# EAGLE design nr1 (EAGLE 6.6.0)
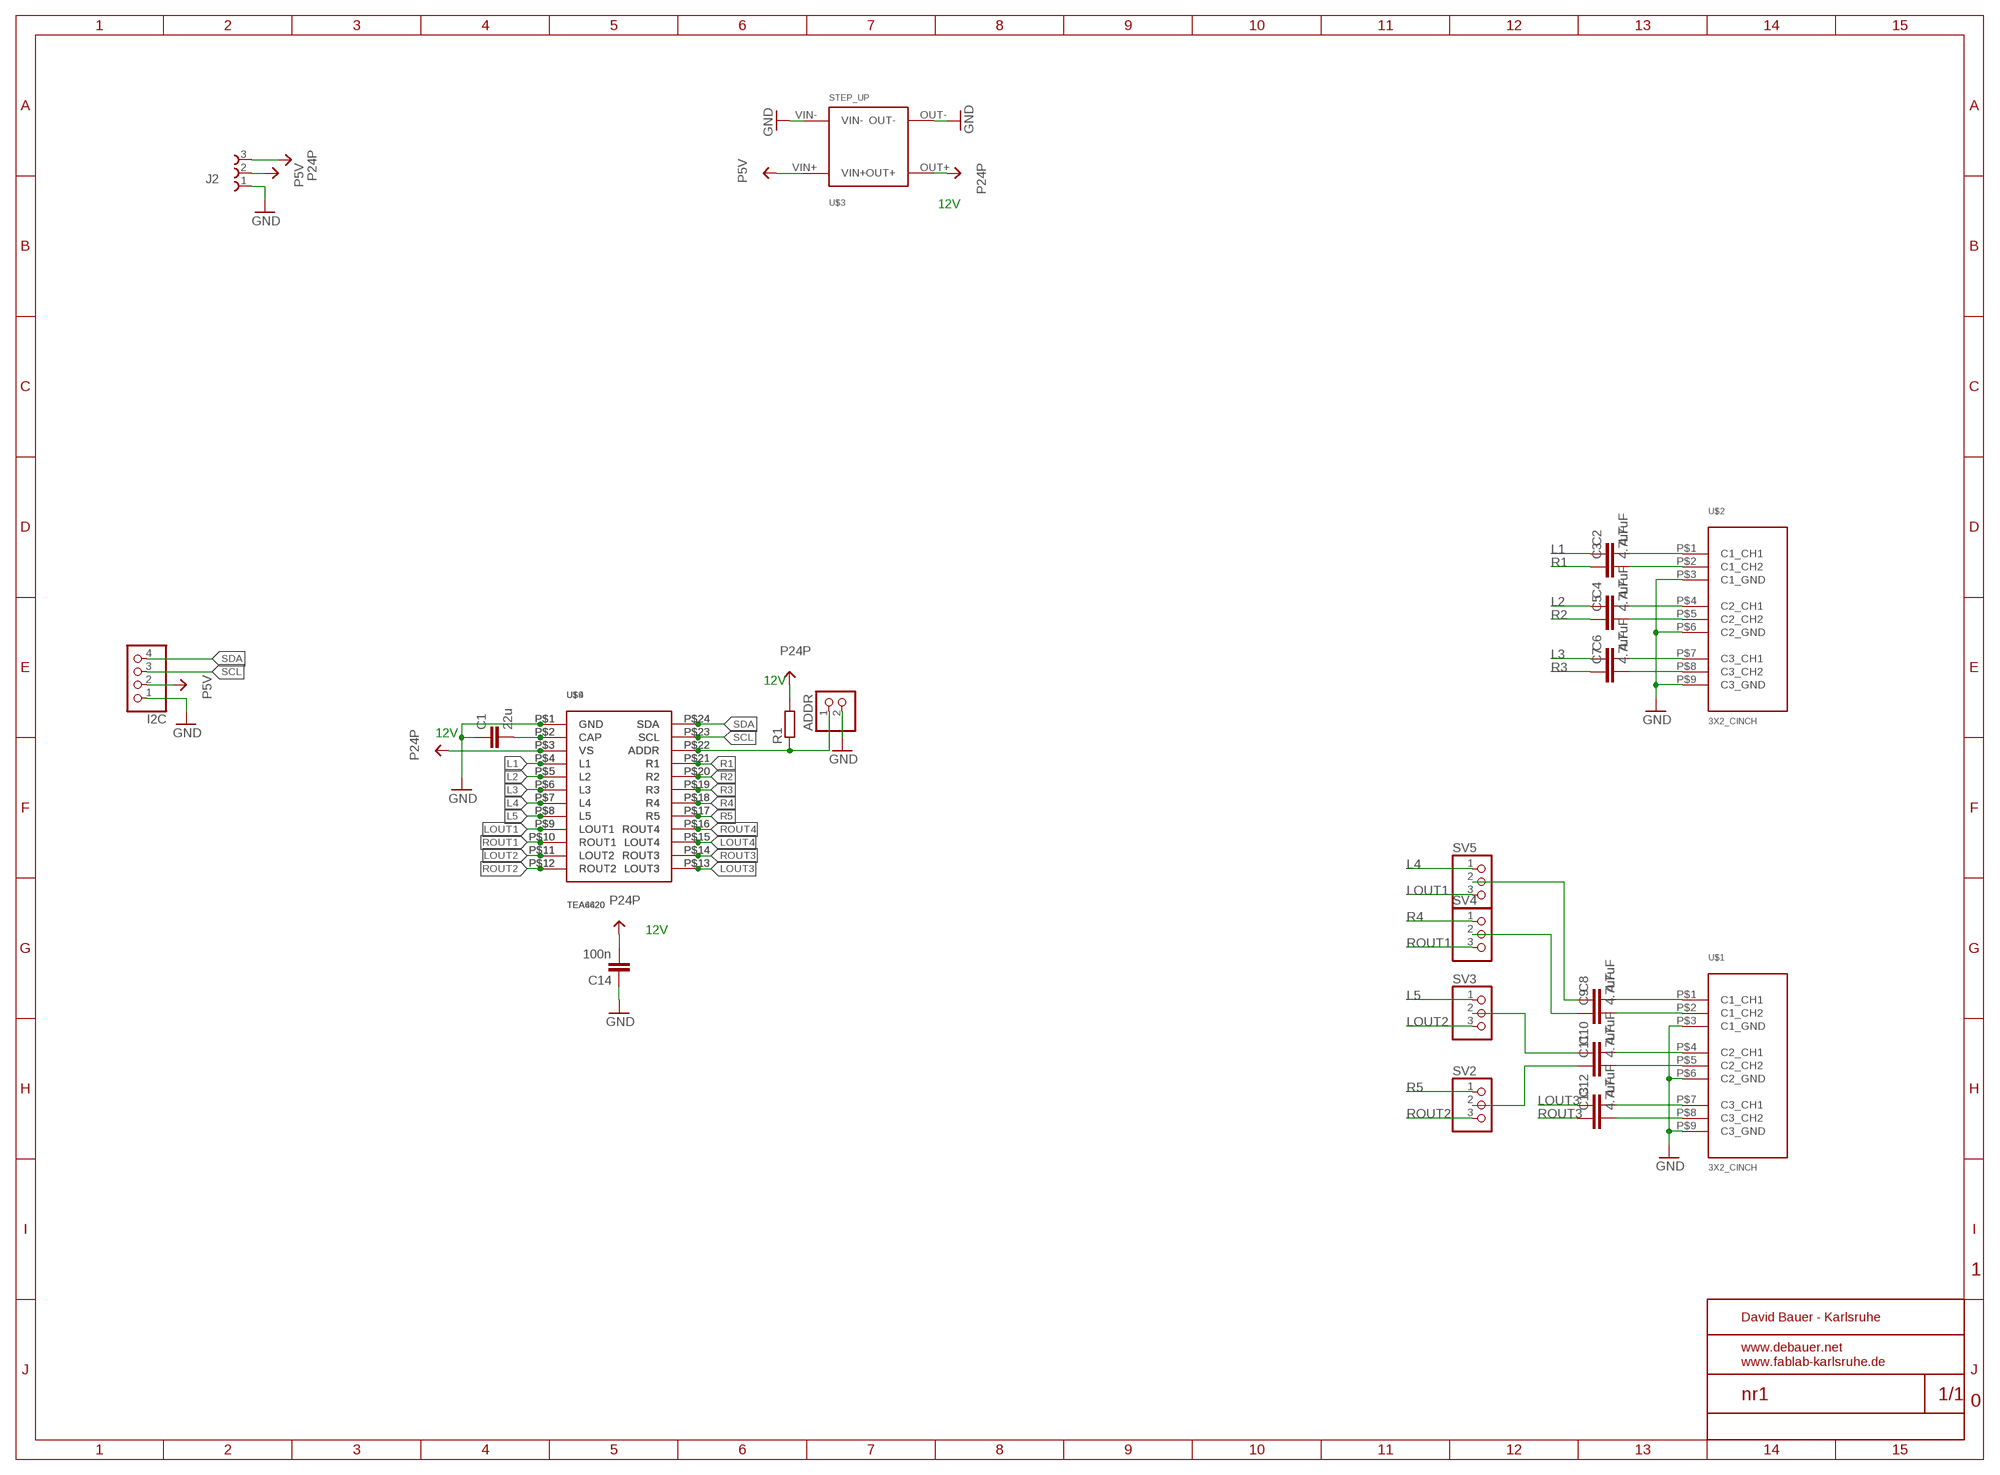
[diagram p0: schematic, sheet 1]

## Parts
ADDR  PINHD-1X2  [1X02]
C1  22u  C-EUC0805  [C0805]
C2  4.7uF  C-EUC0805  [C0805]
C3  4.7uF  C-EUC0805  [C0805]
C4  4.7uF  C-EUC0805  [C0805]
C5  4.7uF  C-EUC0805  [C0805]
C6  4.7uF  C-EUC0805  [C0805]
C7  4.7uF  C-EUC0805  [C0805]
C8  4.7uF  C-EUC0805  [C0805]
C9  4.7uF  C-EUC0805  [C0805]
C10  4.7uF  C-EUC0805  [C0805]
C11  4.7uF  C-EUC0805  [C0805]
C12  4.7uF  C-EUC0805  [C0805]
C13  4.7uF  C-EUC0805  [C0805]
C14  100n  C-EUC0805  [C0805]
I2C  PINHD-1X4  [1X04]
J2  691210910003  [691210910003]
R1  R-EU_R0805  [R0805]
SV2  PINHD-1X3  [1X03]
SV3  PINHD-1X3  [1X03]
SV4  PINHD-1X3  [1X03]
SV5  PINHD-1X3  [1X03]
U$1  3X2_CINCH  [3X2_CINCH]
U$2  3X2_CINCH  [3X2_CINCH]
U$3  STEP_UP  [STEP_UP]
U$4  TEA4620  [TEA4620]
U$9  TEA6420  [SHRINK24]

## Nets
GND: ADDR.2 C1.1 C14.1 I2C.1 J2.1 U$1.P$3(C1_GND) U$1.P$6(C2_GND) U$1.P$9(C3_GND) U$2.P$3(C1_GND) U$2.P$6(C2_GND) U$2.P$9(C3_GND) U$3.OUT- U$3.VIN- U$4.P$1(GND) U$9.P$1(GND)
L1: C2.1 U$4.P$4(L1) U$9.P$4(L1)
L2: C4.1 U$4.P$5(L2) U$9.P$5(L2)
L3: C6.1 U$4.P$6(L3) U$9.P$6(L3)
L4: SV5.1 U$4.P$7(L4) U$9.P$7(L4)
L5: SV3.1 U$4.P$8(L5) U$9.P$8(L5)
LOUT1: SV5.3 U$4.P$9(LOUT1) U$9.P$9(LOUT1)
LOUT2: SV3.3 U$4.P$11(LOUT2) U$9.P$11(LOUT2)
LOUT3: C12.1 U$4.P$13(LOUT3) U$9.P$13(LOUT3)
LOUT4: U$4.P$15(LOUT4) U$9.P$15(LOUT4)
N$1: C8.1 SV5.2
N$2: C9.1 SV4.2
N$7: ADDR.1 R1.1 U$4.P$22(ADDR) U$9.P$22(ADDR)
N$8: C1.2 U$4.P$2(CAP) U$9.P$2(CAP)
N$9: C10.1 SV3.2
N$10: C11.1 SV2.2
N$26: C2.2 U$2.P$1(C1_CH1)
N$27: C3.2 U$2.P$2(C1_CH2)
N$28: C4.2 U$2.P$4(C2_CH1)
N$29: C5.2 U$2.P$5(C2_CH2)
N$30: C6.2 U$2.P$7(C3_CH1)
N$31: C7.2 U$2.P$8(C3_CH2)
N$32: C8.2 U$1.P$1(C1_CH1)
N$33: C9.2 U$1.P$2(C1_CH2)
N$34: C10.2 U$1.P$4(C2_CH1)
N$35: C11.2 U$1.P$5(C2_CH2)
N$36: C12.2 U$1.P$7(C3_CH1)
N$37: C13.2 U$1.P$8(C3_CH2)
P5V: I2C.2 J2.2 U$3.VIN+
P24P: C14.2 J2.3 R1.2 U$3.OUT+ U$4.P$3(VS) U$9.P$3(VS)
R1: C3.1 U$4.P$21(R1) U$9.P$21(R1)
R2: C5.1 U$4.P$20(R2) U$9.P$20(R2)
R3: C7.1 U$4.P$19(R3) U$9.P$19(R3)
R4: SV4.1 U$4.P$18(R4) U$9.P$18(R4)
R5: SV2.1 U$4.P$17(R5) U$9.P$17(R5)
ROUT1: SV4.3 U$4.P$10(ROUT1) U$9.P$10(ROUT1)
ROUT2: SV2.3 U$4.P$12(ROUT2) U$9.P$12(ROUT2)
ROUT3: C13.1 U$4.P$14(ROUT3) U$9.P$14(ROUT3)
ROUT4: U$4.P$16(ROUT4) U$9.P$16(ROUT4)
SCL: I2C.3 U$4.P$23(SCL) U$9.P$23(SCL)
SDA: I2C.4 U$4.P$24(SDA) U$9.P$24(SDA)

## Notes on the sheet
- 12V
- 12V
- 12V
- 12V

## Library data of the parts
ADDR = pinhead:PINHD-1X2: PIN HEADER
C1-C14 = debauer_passiv:C-EU: CAPACITOR, European symbol
I2C = pinhead:PINHD-1X4: PIN HEADER
J2 = Wuerth_TERMINAL_BLOCKS_rev16a:691210910003: WR-TBL Serie 2109 - 2.54mm Horizontal Entry Modular with Rising Cage Clamp - 0.8mm2 Wires, 3 Pins=>Code : Con_TBL_Screw_RisingClamp_2.54_691210910003 <http://katalog.we-online.de/media/images/eican/Con_TBL_Screw_RisingClamp_2.54_6912109100xx_pf2.jpg> Details see: http://katalog.we-online.de/en/em/691_210_910_0xx Created 2014-06-17, Karrer Zheng 2014 (C) Würth Elektronik
R1 = debauer_passiv:R-EU_: RESISTOR, European symbol
SV2-SV5 = pinhead:PINHD-1X3: PIN HEADER
U$1 U$2 = CINCH:3X2_CINCH
U$3 = CINCH:STEP_UP
U$4 = CINCH:TEA4620
U$9 = audio:TEA6420

## Board
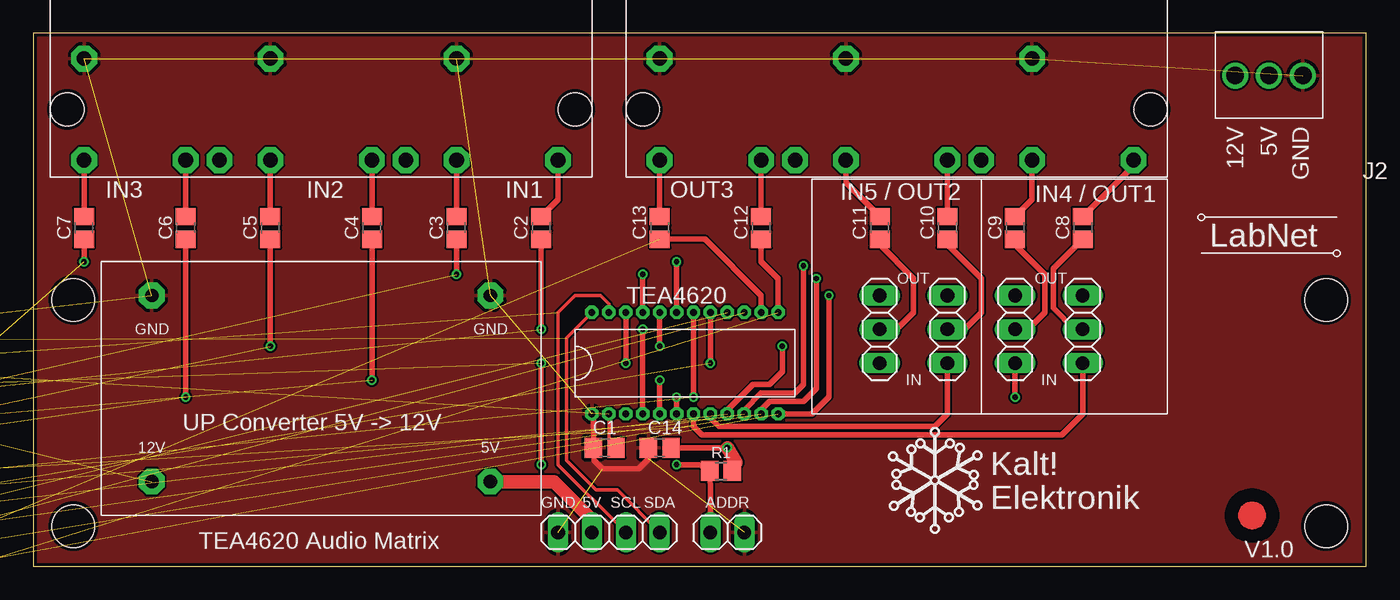
[diagram p1: board, top side]
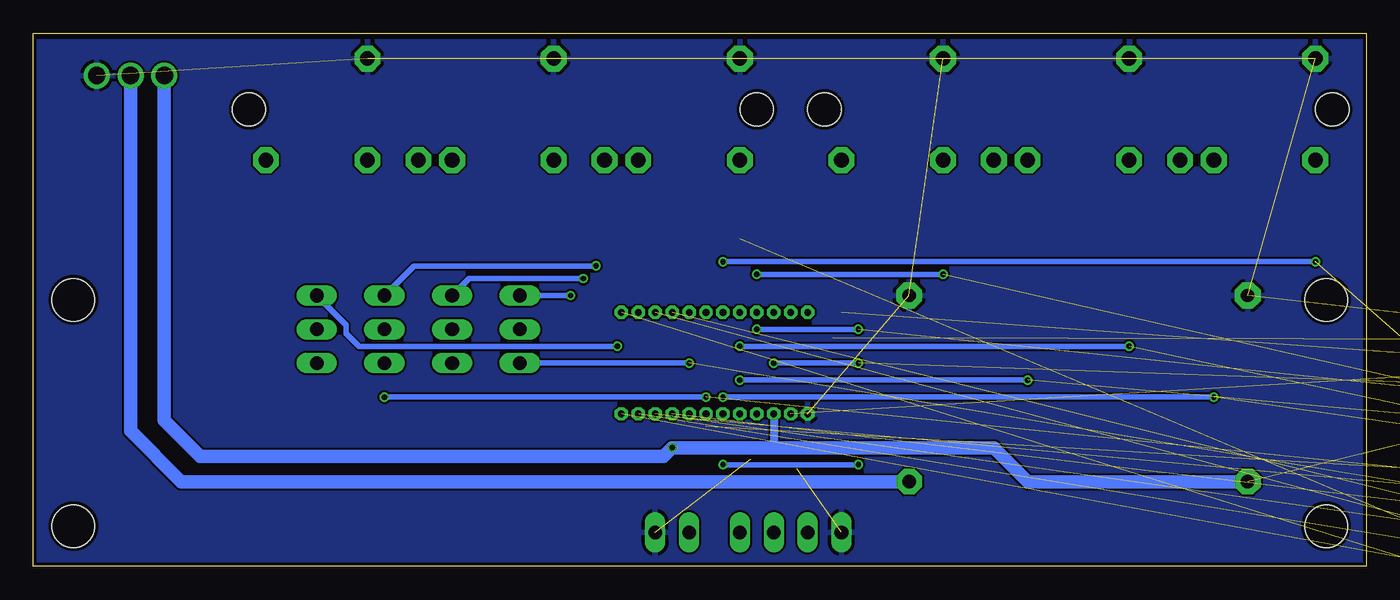
[diagram p2: board, bottom side, seen from below]

Size 100 x 40 mm. Coordinates in mm from the lower left corner, seen from the top.
Outline: 0,0 100,0 100,40 0,40 0,0
Copper layers (1+16): Top 0.035mm / dielectric 1.5mm / Bottom 0.035mm
Design rules "ITEADstudio_DRC *": minimum track width 6mil, minimum drill 12mil, track to track 6mil, track to pad 6mil, pad to pad 6mil, via to via 6mil, smd to smd 0mil, copper to edge 10mil, drill to drill 10mil, minimum pad ring 10mil, minimum via ring 6mil, stop-mask expansion 2mil, vias tented up to drill 100mil, thermal gap 10mil
Holes 3.2 mm at 97,3 3,3 3,20 97,20

### Footprints (pad centres in the part's own frame; a part is rotated, then mirrored left to right if it is on the bottom)
1X02 = drill 1.016 long: 1 -1.27,0; 2 1.27,0
C0805 = smd 1.3 x 1.5: 1 -0.85,0; 2 0.85,0
1X04 = drill 1.016 long: 1 -3.81,0; 2 -1.27,0; 3 1.27,0; 4 3.81,0
691210910003 = drill 1.3: 1 -2.54,0; 2 0,0; 3 2.54,0
R0805 = smd 1.3 x 1.5: 1 -0.85,0; 2 0.85,0
1X03 = drill 1.016 long: 1 -2.54,0; 2 0,0; 3 2.54,0
3X2_CINCH = drill 1.1 pad 1.93 octagon: P$1 -16.51,5.08; P$2 -8.89,5.08; P$3 -8.89,-2.54; P$4 -2.54,5.08; P$5 5.08,5.08; P$6 5.08,-2.54; P$7 11.43,5.08; P$8 19.05,5.08; P$9 19.05,-2.54; P$10 8.89,5.08; P$11 -5.08,5.08 | hole 2.5: -17.78,1.27; 20.32,1.27
STEP_UP = drill 1 pad 1.93 octagon: OUT+ 25.4,0; OUT- 25.4,-13.97; VIN+ 0,0; VIN- 0,-13.97
TEA4620 = drill 0.5 octagon: P$1 -3.81,6.35; P$2 -3.81,5.08; P$3 -3.81,3.81; P$4 -3.81,2.54; P$5 -3.81,1.27; P$6 -3.81,0; P$7 -3.81,-1.27; P$8 -3.81,-2.54; P$9 -3.81,-3.81; P$10 -3.81,-5.08; P$11 -3.81,-6.35; P$12 -3.81,-7.62; P$13 3.81,-7.62; P$14 3.81,-6.35; P$15 3.81,-5.08; P$16 3.81,-3.81; P$17 3.81,-2.54; P$18 3.81,-1.27; P$19 3.81,0; P$20 3.81,1.27; P$21 3.81,2.54; P$22 3.81,3.81; P$23 3.81,5.08; P$24 3.81,6.35
SHRINK24 = drill 0.5 octagon: P$1 -3.556,10.668; P$2 -3.556,8.89; P$3 -3.556,7.112; P$4 -3.556,5.334; P$5 -3.556,3.556; P$6 -3.556,1.778; P$7 -3.556,0; P$8 -3.556,-1.778; P$9 -3.556,-3.556; P$10 -3.556,-5.334; P$11 -3.556,-7.112; P$12 -3.556,-8.89; P$13 3.556,-8.89; P$14 3.556,-7.112; P$15 3.556,-5.334; P$16 3.556,-3.556; P$17 3.556,-1.778; P$18 3.556,0; P$19 3.556,1.778; P$20 3.556,3.556; P$21 3.556,5.334; P$22 3.556,7.112; P$23 3.556,8.89; P$24 3.556,10.668

### Placement (x,y rotation side)
ADDR  52.07,2.54 0 top
C1  42.86,8.89 0 top
C2  38.1,25.4 90 top
C3  31.75,25.4 90 top
C4  25.4,25.4 90 top
C5  17.78,25.4 90 top
C6  11.43,25.4 90 top
C7  3.81,25.4 90 top
C8  78.74,25.4 90 top
C9  73.66,25.4 90 top
C10  68.58,25.4 90 top
C11  63.5,25.4 90 top
C12  54.61,25.4 90 top
C13  46.99,25.4 90 top
C14  46.99,8.89 0 top
I2C  43.18,2.54 0 top
J2  92.71,36.83 180 top
R1  51.59,7.14 0 top
SV2  63.5,17.78 90 top
SV3  68.58,17.78 90 top
SV4  73.66,17.78 90 top
SV5  78.74,17.78 90 top
U$1  66.04,35.56 180 top
U$2  22.86,35.56 180 top
U$3  34.29,6.35 180 top
U$4  48.26,15.24 90 top
U$6  [PASSMARK]  91.44,3.81 0 top
U$7  [LABNET]  92.71,24.13 0 top
U$8  [KALT!ELEKTRONIK]  74.93,6.35 0 top
U$9  -16.51,6.35 0 top  (outside the outline)

### Tracks (layer width: path | path; a pad name or v marks a point on that pad's centre or on a via)
GND  (12 unrouted)
  Top 0.406: U$4.P$1 42.01,11.33 C1.1 42.07,8.83 42.07,7.94 42.7,7.3 45.4,7.3 46.14,8.04 C14.1
  pour Bottom: 0,39.37 100.33,39.37 100.33,0 0,0
  pour Top: -11.43,48.26 104.14,48.26 104.14,-6.35 -11.43,-6.35
L1  (via drill 0.4)  (1 unrouted)
  Top 0.406: U$4.P$4 v45.72,17.78 | v38.1,17.78 C2.1
  Bottom 0.406: v45.72,17.78 v38.1,17.78
L2  (via drill 0.4)  (1 unrouted)
  Top 0.406: C4.1 v25.4,13.97 | v46.99,13.97 U$4.P$5
  Bottom 0.406: v25.4,13.97 v46.99,13.97
L3  (via drill 0.4)  (1 unrouted)
  Top 0.406: C6.1 v11.43,12.7 | v48.26,12.7 U$4.P$6
  Bottom 0.406: v11.43,12.7 v48.26,12.7
L4  (1 unrouted)
  Top 0.406: U$4.P$7 49.53,10.48 50.16,9.84 77.15,9.84 78.74,11.43 SV5.1
L5  (1 unrouted)
  Top 0.406: U$4.P$8 50.8,11.11 51.44,10.48 67.63,10.48 68.58,11.43 SV3.1
LOUT1  (via drill 0.4)  (1 unrouted)
  Top 0.406: U$4.P$9 52.07,11.75 53.98,13.65 55.24,13.65 56.2,14.61 v56.2,16.51
  Bottom 0.406: v56.2,16.51 75.56,16.51 76.52,17.46 76.52,18.1 SV5.3
LOUT2  (via drill 0.4)  (1 unrouted)
  Top 0.406: U$4.P$11 54.61,11.75 55.24,12.38 57.78,12.38 58.74,13.34 v58.74,21.59
  Bottom 0.406: v58.74,21.59 67.31,21.59 SV3.3
LOUT3  (1 unrouted)
  Top 0.406: C12.1 54.61,22.86 55.88,21.59 U$4.P$13
LOUT4  (1 unrouted)
N$1
  Top 0.406: SV5.2 78.11,17.78 76.52,19.37 76.52,22.33 C8.1
N$2
  Top 0.406: C9.1 73.66,24.13 75.88,21.91 75.88,19.05 74.61,17.78 SV4.2
N$7  (via drill 0.4)  (1 unrouted)
  Top 0.406: ADDR.1 50.8,5.93 R1.1 49.95,7.62 v48.26,7.62 | U$4.P$22 v44.45,15.24 | v38.1,15.24 v38.1,7.62
  Bottom 0.406: v44.45,15.24 v38.1,15.24 | v38.1,7.62 v48.26,7.62
N$8  (1 unrouted)
  Top 0.254: U$4.P$2 43.18,9.42 C1.2
N$9
  Top 0.406: C10.1 68.58,24.13 71.12,21.59 71.12,19.05 69.85,17.78 SV3.2
N$10
  Top 0.406: C11.1 63.5,24.13 66.04,21.59 66.04,19.05 64.77,17.78 SV2.2
N$26
  Top 0.406: U$2.P$1 39.37,27.52 C2.2
N$27
  Top 0.406: U$2.P$2 C3.2
N$28
  Top 0.406: U$2.P$4 C4.2
N$29
  Top 0.406: U$2.P$5 C5.2
N$30
  Top 0.406: U$2.P$7 C6.2
N$31
  Top 0.406: U$2.P$8 C7.2
N$32
  Top 0.406: U$1.P$1 82.55,30.06 C8.2
N$33
  Top 0.406: U$1.P$2 74.93,27.52 C9.2
N$34
  Top 0.406: U$1.P$4 C10.2
N$35
  Top 0.406: U$1.P$5 60.96,28.79 C11.2
N$36
  Top 0.406: U$1.P$7 C12.2
N$37
  Top 0.406: U$1.P$8 C13.2
P5V
  Top 1.016: U$3.VIN+ 39.05,6.35 41.91,3.49 I2C.2
  Bottom 1.016: U$3.VIN+ 88.9,6.35 92.71,10.16 J2.2
P24P  (via drill 0.4)  (1 unrouted)
  Top 0.406: C14.2 v52.07,8.89
  Top 1.016: v52.07,8.89 52.7,7.78 52.39,7.56 R1.2
  Bottom 0.61: U$4.P$3 44.45,8.89
  Bottom 1.016: U$3.OUT+ 25.4,6.35 27.94,8.89 44.45,8.89 v52.07,8.89 52.7,8.26 87.47,8.26 90.17,10.95 J2.3
R1  (via drill 0.4)  (1 unrouted)
  Top 0.406: C3.1 v31.75,21.91 | v45.72,21.91 U$4.P$21
  Bottom 0.406: v31.75,21.91 v45.72,21.91
R2  (via drill 0.4)  (1 unrouted)
  Top 0.406: C5.1 v17.78,16.51 | v46.99,16.51 U$4.P$20
  Bottom 0.406: v17.78,16.51 v46.99,16.51
R3  (via drill 0.4)  (1 unrouted)
  Top 0.406: C7.1 v3.81,22.86 | v48.26,22.86 U$4.P$19
  Bottom 0.406: v3.81,22.86 v48.26,22.86
R4  (via drill 0.4)  (1 unrouted)
  Top 0.406: SV4.1 v73.66,12.7 | v49.53,12.7 U$4.P$18
  Bottom 0.406: v73.66,12.7 v49.53,12.7
R5  (via drill 0.4)  (1 unrouted)
  Top 0.406: v50.8,15.24 U$4.P$17
  Bottom 0.406: SV2.1 v50.8,15.24
ROUT1  (via drill 0.4)  (1 unrouted)
  Top 0.406: U$4.P$10 53.34,11.75 54.61,13.02 57.15,13.02 57.78,13.65 v57.78,22.54
  Bottom 0.406: v57.78,22.54 71.44,22.54 SV4.3
ROUT2  (via drill 0.4)  (1 unrouted)
  Top 0.406: U$4.P$12 58.42,11.43 59.69,12.7 v59.69,20.32
  Bottom 0.406: v59.69,20.32 SV2.3
ROUT3  (1 unrouted)
  Top 0.406: C13.1 50.38,24.55 54.61,20.32 U$4.P$14
ROUT4  (1 unrouted)
SCL  (1 unrouted)
  Top 0.254: I2C.3 39.37,7.62 39.37,19.05 40.64,20.32 42.55,20.32 43.18,19.68 U$4.P$23
SDA  (1 unrouted)
  Top 0.254: I2C.4 43.81,5.71 42.23,5.71 40.01,7.94 40.01,17.14 U$4.P$24

### Text on the board
tPlace: 12V | 5V | GND | IN3 | IN2 | IN1 | OUT3 | IN5 / OUT2 | IN4 / OUT1 | OUT | OUT | TEA4620 | GND | GND | IN | IN | UP Converter 5V -> 12V | 12V | 5V | GND | 5V | SCL | SDA | ADDR | TEA4620 Audio Matrix | V1.0